# Altium schematic sheet USB.SchDoc
size A
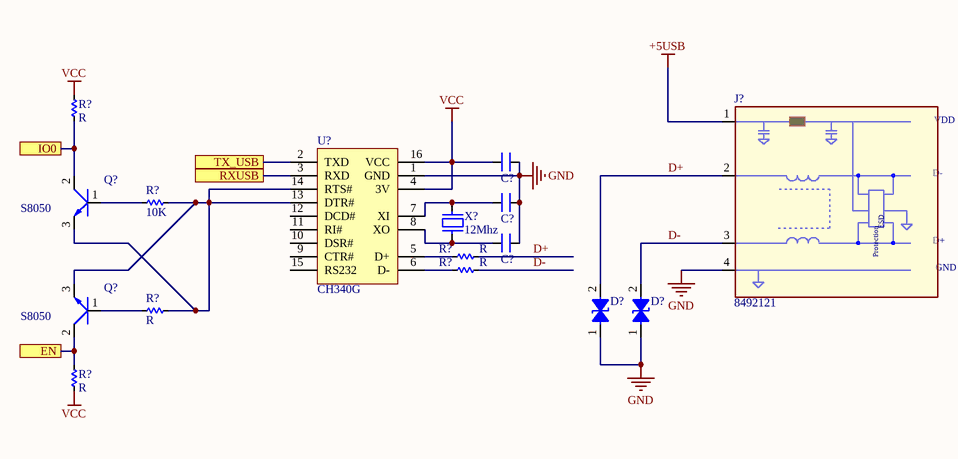
[diagram p0: USB.SchDoc]

## Parts
(Parts that share a designator on the sheet are numbered #1, #2 ... from top to bottom, then left to right.)
C?#1  CN  [CN-SMD-0603_big]  (value not drawn)
C?#2  CN  [CN-SMD-0603_big]  (value not drawn)
C?#3  CN  [CN-SMD-0603_big]  (value not drawn)
D?#1  TVS Diode  [DIO-SMD-214AC]  (value not drawn)
D?#2  TVS Diode  [DIO-SMD-214AC]  (value not drawn)
J?  8492121  [USB-C2]
Q?#1  S8050  [SOT23-123]
Q?#2  S8050  [SOT23-123]
R?#1  R  [RES-SMD-0603_BIG]
R?#2  10K  [RES-SMD-0603_BIG]
R?#3  R  [RES-SMD-0603_BIG]
R?#4  R  [RES-SMD-0603_BIG]
R?#5  R  [RES-SMD-0603_BIG]
R?#6  R  [RES-SMD-0603_BIG]
U?  CH340G  [SO16]
X?  12Mhz  [XT2]

## Ports
EN, IO0, RXUSB, TX_USB

## Nets
+5USB: J?.1(VBUS)
GND: C?#1.1 C?#2.1 C?#3.1 D?#1.1(I/O_1) D?#2.1(I/O_1) J?.4(GND) U?.1(GND)
VCC: C?#1.2 R?#1.1 R?#6.2 U?.4(3V) U?.16(VCC)
D+: D?#1.2(GND) J?.2(D-) R?#3.1
D-: D?#2.2(GND) J?.3(D+) R?#4.1
EN: Q?#2.2(C) R?#6.1 ; port EN
IO0: Q?#1.2(C) R?#1.2 ; port IO0
RXUSB: U?.3(RXD) ; port RXUSB
TX_USB: U?.2(TXD) ; port TX_USB
NetC?#2_2: C?#2.2 U?.7(XI) X?.2
NetC?#3_2: C?#3.2 U?.8(XO) X?.1
NetQ?#1_1: Q?#1.1(B) R?#2.2
NetQ?#1_3: Q?#1.3(E) Q?#2.3(E) R?#2.1 R?#5.1 U?.13(DTR#) U?.14(RTS#)
NetQ?#2_1: Q?#2.1(B) R?#5.2
NetR?#3_2: R?#3.2 U?.5(D+)
NetR?#4_2: R?#4.2 U?.6(D-)

Not connected (* = marked no-connect by the designer): U? 9(CTR#) 10(DSR#) 11(RI#) 12(DCD#) 15(RS232)

## Notes on the sheet
- (in symbol USB-4) VDD; ESD; Protection

## Library data of the parts
C?#1-C?#3 = CN: Value: 33pF
D?#1 D?#2 = TVS Diode: SMAJ5.0A
J? = USB-4: THT USB 2.0 A Connector WE-EPLE; Manufacturer: Würth Elektronik eiSos GmbH; PartNo: 8492121; ComponentLink1Description: Manufacturer; ComponentLink1URL: http://www.we-online.de; Created by: Christin Otto; Created Date: OCT-2014; ComponentLink2Description: Datasheet; ComponentLink2URL: http://www.we-online.de/katalog/media/pdf/8492121.pdf
Q?#1 Q?#2 = S8050: NPN 600mW, ECB; Value: C1815
R?#2 = R
U? = CH340G: High and Low Side Driver; Note: Pins 4, 8 and 14 are not connected; Published: 8-Jun-2000; LatestRevisionDate: 04-Mar-2005; LatestRevisionNote: Stylized 3D Model Added.; DatasheetVersion: PD60147J; PackageReference: PDIP14; Publisher: Altium Limited; PackageDescription: DIP; 14 Leads; Row Spacing 7.62 mm; Pitch 2.54 mm; ComponentLink1Description: Manufacturer Link; ComponentLink1URL: http://www.irf.com/; ComponentLink2Description: Datasheet; ComponentLink2URL: http://www.irf.com/product-info/datasheets/data/ir2110.pdf
X? = XT2: Crystal, 32.768 KHz, -40 to 85 degC, 3.2 x 1.5 x 0.9 mm SMD; Value: 4Mhz